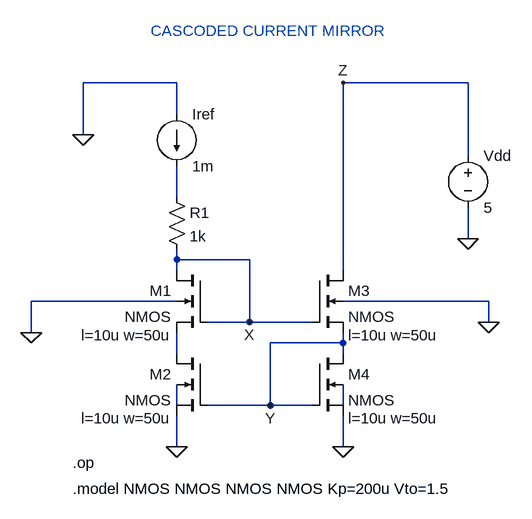
[diagram p0: schematic 12)cascode.asc]
12)cascode.asc, the LTspice schematic file:
Version 4
SHEET 1 880 680
WIRE 48 -224 -96 -224
WIRE 496 -224 304 -224
WIRE 48 -176 48 -224
WIRE -96 -144 -96 -224
WIRE 496 -112 496 -224
WIRE 48 -48 48 -96
WIRE 496 16 496 -32
WIRE 48 48 48 32
WIRE 160 48 48 48
WIRE 48 64 48 48
WIRE 304 64 304 -224
WIRE 48 112 -176 112
WIRE 528 112 304 112
WIRE 160 144 160 48
WIRE 160 144 96 144
WIRE 256 144 160 144
WIRE 528 144 528 112
WIRE -176 160 -176 112
WIRE 304 176 304 160
WIRE 304 176 192 176
WIRE 48 192 48 160
WIRE 304 192 304 176
WIRE 48 272 48 240
WIRE 192 272 192 176
WIRE 192 272 96 272
WIRE 256 272 192 272
WIRE 304 272 304 240
WIRE 48 336 48 288
WIRE 304 336 304 288
FLAG 48 336 0
FLAG 304 336 0
FLAG -96 -144 0
FLAG 496 16 0
FLAG -176 160 0
FLAG 528 144 0
FLAG 160 144 X
FLAG 192 272 Y
FLAG 304 -224 Z
SYMBOL nmos4 96 64 M0
WINDOW 123 56 100 Left 2
SYMATTR Value2 l=10u w=50u
SYMATTR InstName M1
SYMBOL nmos4 96 192 M0
WINDOW 123 56 100 Left 2
SYMATTR Value2 l=10u w=50u
SYMATTR InstName M2
SYMBOL nmos4 256 64 R0
WINDOW 123 56 100 Left 2
SYMATTR Value2 l=10u w=50u
SYMATTR InstName M3
SYMBOL nmos4 256 192 R0
WINDOW 123 56 100 Left 2
SYMATTR Value2 l=10u w=50u
SYMATTR InstName M4
SYMBOL res 32 -64 R0
SYMATTR InstName R1
SYMATTR Value 1k
SYMBOL current 48 -176 R0
WINDOW 123 0 0 Left 0
WINDOW 39 0 0 Left 0
SYMATTR InstName Iref
SYMATTR Value 1m
SYMBOL voltage 496 -128 R0
WINDOW 123 0 0 Left 0
WINDOW 39 0 0 Left 0
SYMATTR InstName Vdd
SYMATTR Value 5
TEXT -112 400 Left 2 !.model NMOS NMOS NMOS NMOS Kp=200u Vto=1.5
TEXT -112 360 Left 2 !.op
TEXT 8 -304 Left 2 ;CASCODED CURRENT MIRROR

The netlist it stands for:
* 12)cascode.asc
M1 X X N002 0 NMOS l=10u w=50u
M2 N002 Y 0 N003 NMOS l=10u w=50u
M3 Z X Y 0 NMOS l=10u w=50u
M4 Y Y 0 N004 NMOS l=10u w=50u
R1 N001 X 1k
Iref 0 N001 1m
Vdd Z 0 5
.model NMOS NMOS
.model PMOS PMOS
.lib standard.mos
.model NMOS NMOS NMOS NMOS Kp=200u Vto=1.5
.op
* CASCODED CURRENT MIRROR
.backanno
.end